# Altium schematic sheet ARM_LIMIT_SW.SchDoc: Title
size A4; Date: *******; ApprovedBy: *******; CheckedBy: None; Author: *******; CompanyName: *******; DrawnBy: Jacob Chisholm; Engineer: *******; Organization: *******; Address1: *******; Address2: *******; Address3: *******; Address4: *******; DocumentNumber: 8; Revision: *******; SheetNumber: 8; SheetTotal: 9; Address_Website: https://jchisholm204.github.io; E-Mail: JacobChisholm1010@gmail.com; CurrentTime: *******; CurrentDate: *******; Time: *******; DocumentFullPathAndName: *******; DocumentName: *******; ModifiedDate: *******; ImagePath: *******; ProjectName: *******; Application_BuildNumber: *******
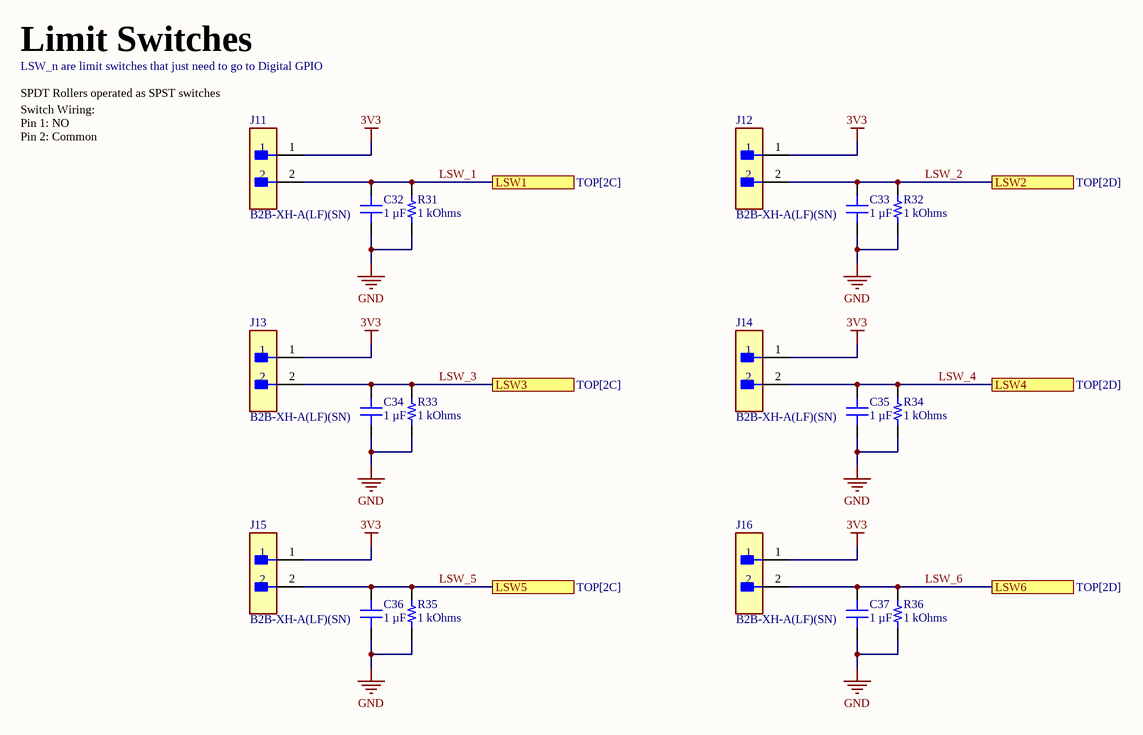
[diagram p0: ARM_LIMIT_SW.SchDoc]

## Parts
C32  1 µF  [CAP 0603_1608]
C33  1 µF  [CAP 0603_1608]
C34  1 µF  [CAP 0603_1608]
C35  1 µF  [CAP 0603_1608]
C36  1 µF  [CAP 0603_1608]
C37  1 µF  [CAP 0603_1608]
J11  B2B-XH-A(LF)(SN)  [FP-B2B-XH-A_LF_SN-MFG]
J12  B2B-XH-A(LF)(SN)  [FP-B2B-XH-A_LF_SN-MFG]
J13  B2B-XH-A(LF)(SN)  [FP-B2B-XH-A_LF_SN-MFG]
J14  B2B-XH-A(LF)(SN)  [FP-B2B-XH-A_LF_SN-MFG]
J15  B2B-XH-A(LF)(SN)  [FP-B2B-XH-A_LF_SN-MFG]
J16  B2B-XH-A(LF)(SN)  [FP-B2B-XH-A_LF_SN-MFG]
R31  1 kOhms  [RES 0603_1608]
R32  1 kOhms  [RES 0603_1608]
R33  1 kOhms  [RES 0603_1608]
R34  1 kOhms  [RES 0603_1608]
R35  1 kOhms  [RES 0603_1608]
R36  1 kOhms  [RES 0603_1608]

## Ports
LSW1 (see TOP[2C]), LSW2 (see TOP[2D]), LSW3 (see TOP[2C]), LSW4 (see TOP[2D]), LSW5 (see TOP[2C]), LSW6 (see TOP[2D])

## Nets
3V3: J11.1 J12.1 J13.1 J14.1 J15.1 J16.1
GND: C32.1 C33.1 C34.1 C35.1 C36.1 C37.1 R31.1 R32.1 R33.1 R34.1 R35.1 R36.1
\: C35.2 J14.2 R34.2 ; port LSW4  [also labelled LSW_4]
LSW_1: C32.2 J11.2 R31.2 ; port LSW1
LSW_2: C33.2 J12.2 R32.2 ; port LSW2
LSW_3: C34.2 J13.2 R33.2 ; port LSW3
LSW_5: C36.2 J15.2 R35.2 ; port LSW5
LSW_6: C37.2 J16.2 R36.2 ; port LSW6

## Notes on the sheet
- Limit Switches
- LSW_n are limit switches that just need to go to Digital GPIO
- SPDT Rollers operated as SPST switches
- Switch Wiring:
  Pin 1: NO
  Pin 2: Common
- Title:
- Drawn By:
- Page Contents:
- Checked By:
- Size:
- Date:
- File:
- License:
- Email:
- A4
- Number:
- Time:
- Revision:
- Sheet
- Website:
- of

## Library data of the parts
C32-C37 = MD0603BB105K100NHT-EM: CAP CER 1UF 10V X7R 0603; manufacturer: Knowles Novacap; Tolerance: ±10%; Part Number: MD0603BB105K100NHT-EM; Value: 1 µF; Applications: Medical, Non-Critical; Capacitance: 1 µF; componentlink1description: Datasheet; componentlink1url: https://mm.digikey.com/Volume0/opasdata/d220001/medias/docus/5546/MD Series R3.pdf; componentlink2description: DigiKey Link; componentlink2url: https://www.digikey.com/en/products/detail/knowles-novacap/MD0603BB105K100NHT-EM/21406891; Device Package: 0603 (1608 Metric); lastupdated: 2/9/2024 8:08:37 PM; Lifecycle Status: Active; Minimum Order: 1; Mounting Type: Surface Mount, MLCC; Operating Temperature: -55°C ~ 125°C; Package / Case: 0603 (1608 Metric); packaging: TapeAndReel; partid: 57194; price: 0.48; series: MD; Supplier 1: DigiKey; Supplier Part Number 1: 1763-MD0603BB105K100NHT-EMCT-ND; Temperature Coefficient: X7R; Voltage - Rated: 10V
J11-J16 = CMP-2000-05888-3: CONN HEADER VERT 2POS 2.5MM; Current Rating: 3A; Voltage Rating: 250V; Number of Contacts: 2; Contact Resistance: 20mR; Wire/Cable Gauge: 22AWG; Insulation Resistance: 1GR; Connector Type: Male Pin; Packaging: Bulk; Contact Material: Brass; Lead Free: Lead Free; Orientation: Straight; Contact Plating: Tin; Max Current Rating: 3A; Termination: Solder; Fastening Type: Detent; Depth: 5.75mm; Housing Material: Polyamide; REACH SVHC: No SVHC; Series: XH; Voltage Rating (AC): 250V; Number of Positions: 2; Color: Natural; Contact Type: Male Pin; Max Voltage Rating (DC): 250V; Pitch: 2.5mm; Lead Pitch: 2.5mm; Mount: Through Hole; Max Operating Temperature: 85°C; Length: 7.4mm; Max Voltage Rating (AC): 250V; Min Operating Temperature: -25°C; Number of Rows: 1; Housing Color: White
R31-R36 = APC0603B1K00N: 1/16 WATTS PRECISION CHIP 1 KILO; Manufacturer: Ohmite; Power (Watts): 0.063W, 1/16W; Temperature Coefficient: ±25ppm/°C; Tolerance: ±0.1%; Part Number: APC0603B1K00N; Value: 1 kOhms; ComponentLink1Description: Datasheet; ComponentLink1URL: https://www.ohmite.com/assets/docs/APC-1-15.34.pdf; ComponentLink2Description: DigiKey Link; ComponentLink2URL: https://www.digikey.com/en/products/detail/ohmite/APC0603B1K00N/16369506; Composition: Thin Film; Device Package: 0603 (1608 Metric); Height - Seated (Max): 0.022" (0.55mm); LastUpdated: 2/9/2024 8:40:40 PM; Lifecycle Status: Active; Minimum Order: 1; Number of Terminations: 2; Operating Temperature: -55°C ~ 155°C; Package / Case: 0603 (1608 Metric); Packaging: TapeAndReel; PartId: 78336; Part Status: Active; Price: 0.05; Resistance: 1 kOhms; Series: APC; Size / Dimension: 0.061" L x 0.031" W (1.55mm x 0.80mm); Supplier 1: DigiKey; Supplier Part Number 1: 273-APC0603B1K00NCT-ND; Supplier Device Package: 0603